# EAGLE design RWatch (EAGLE 7.3.0)
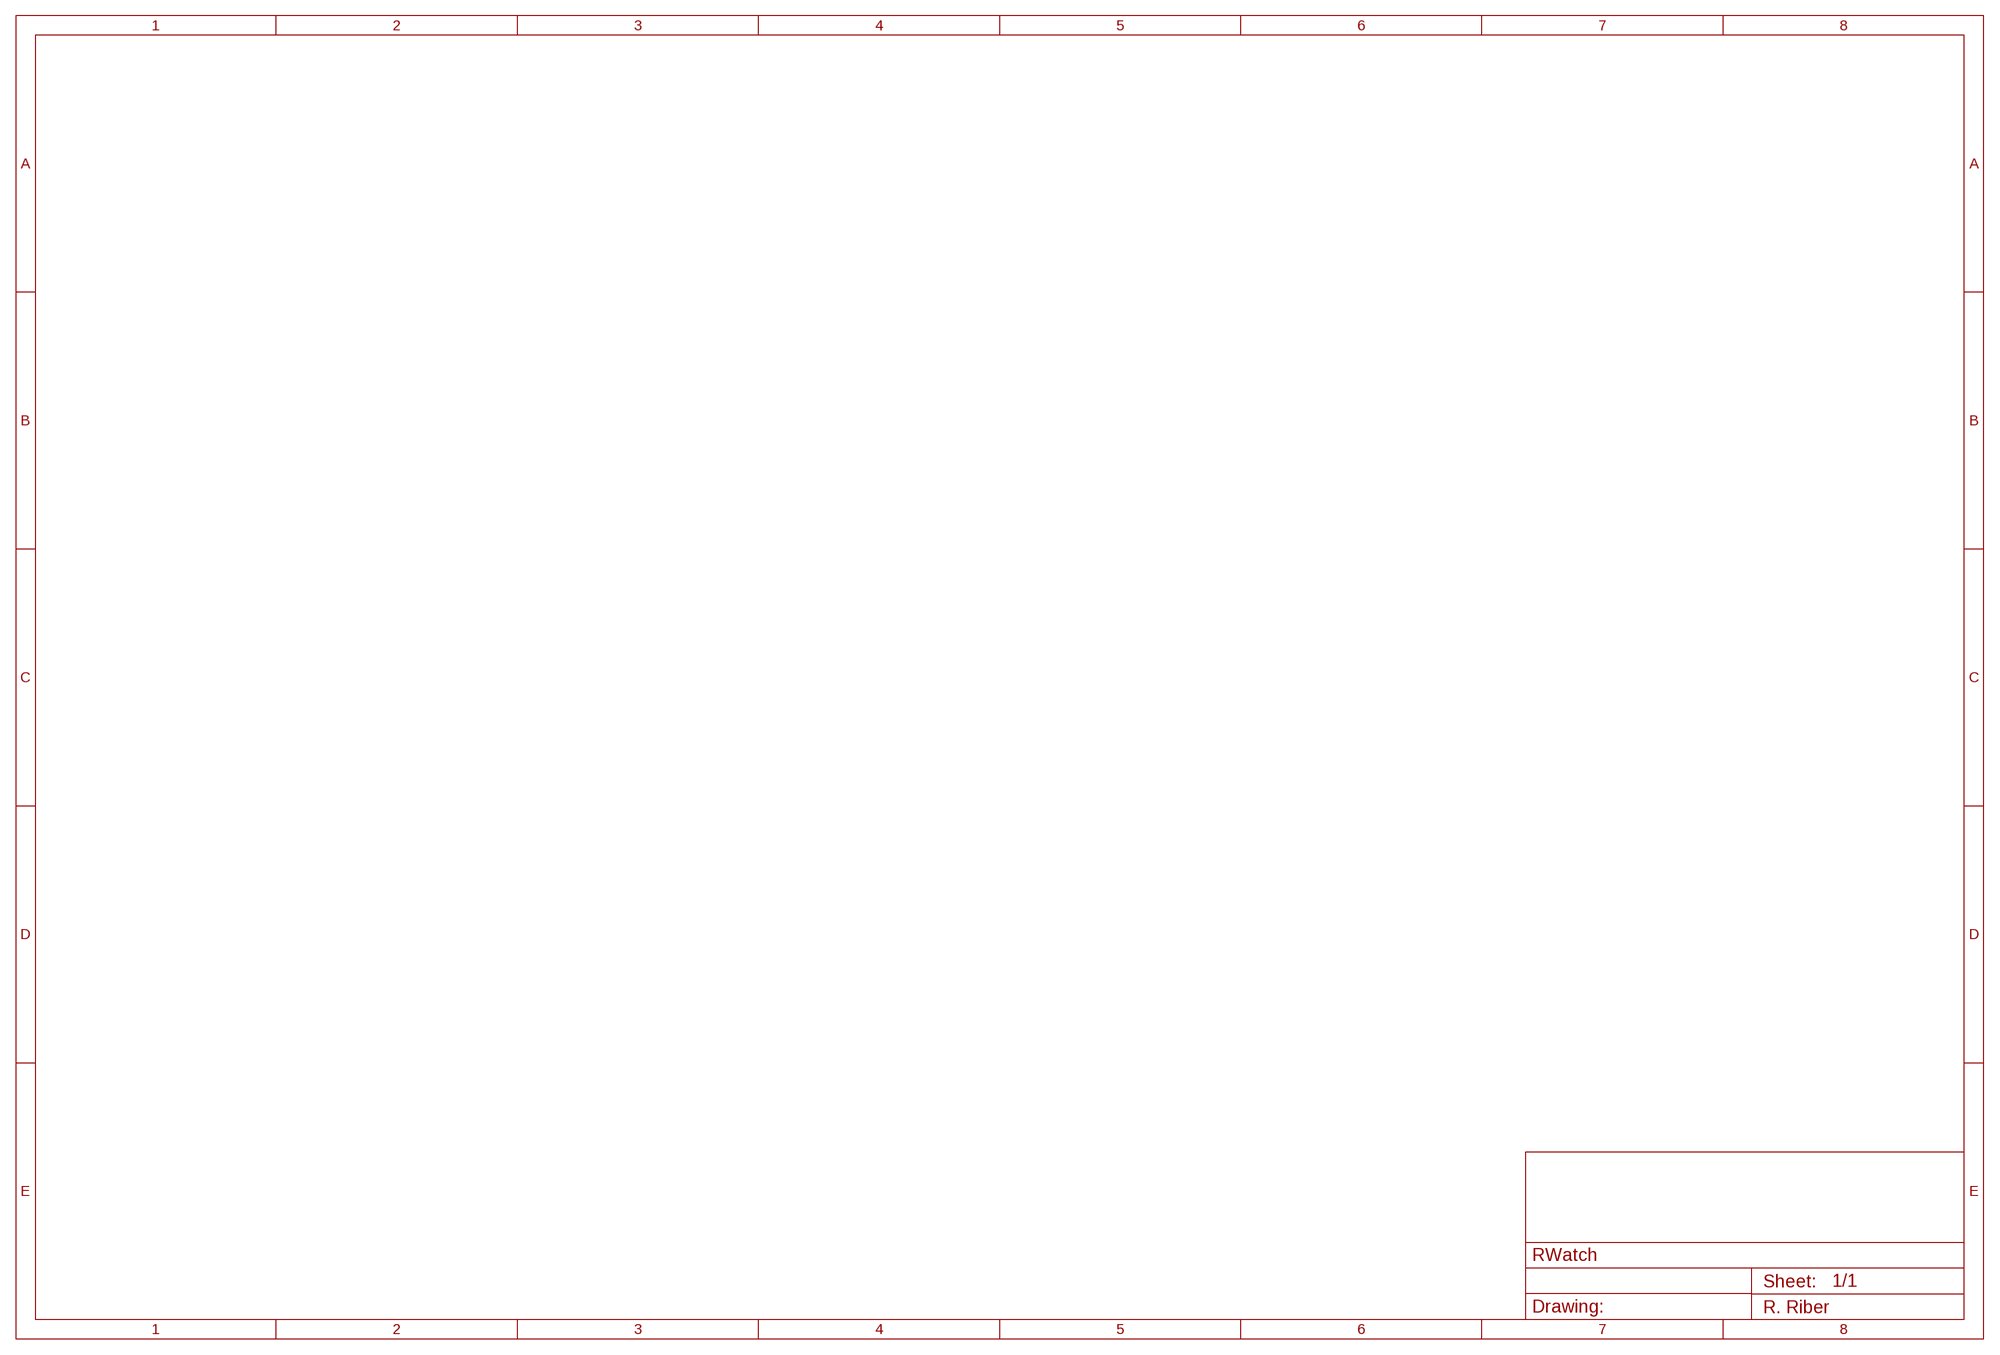
[diagram p0: schematic, sheet 1, part 1 of 2]
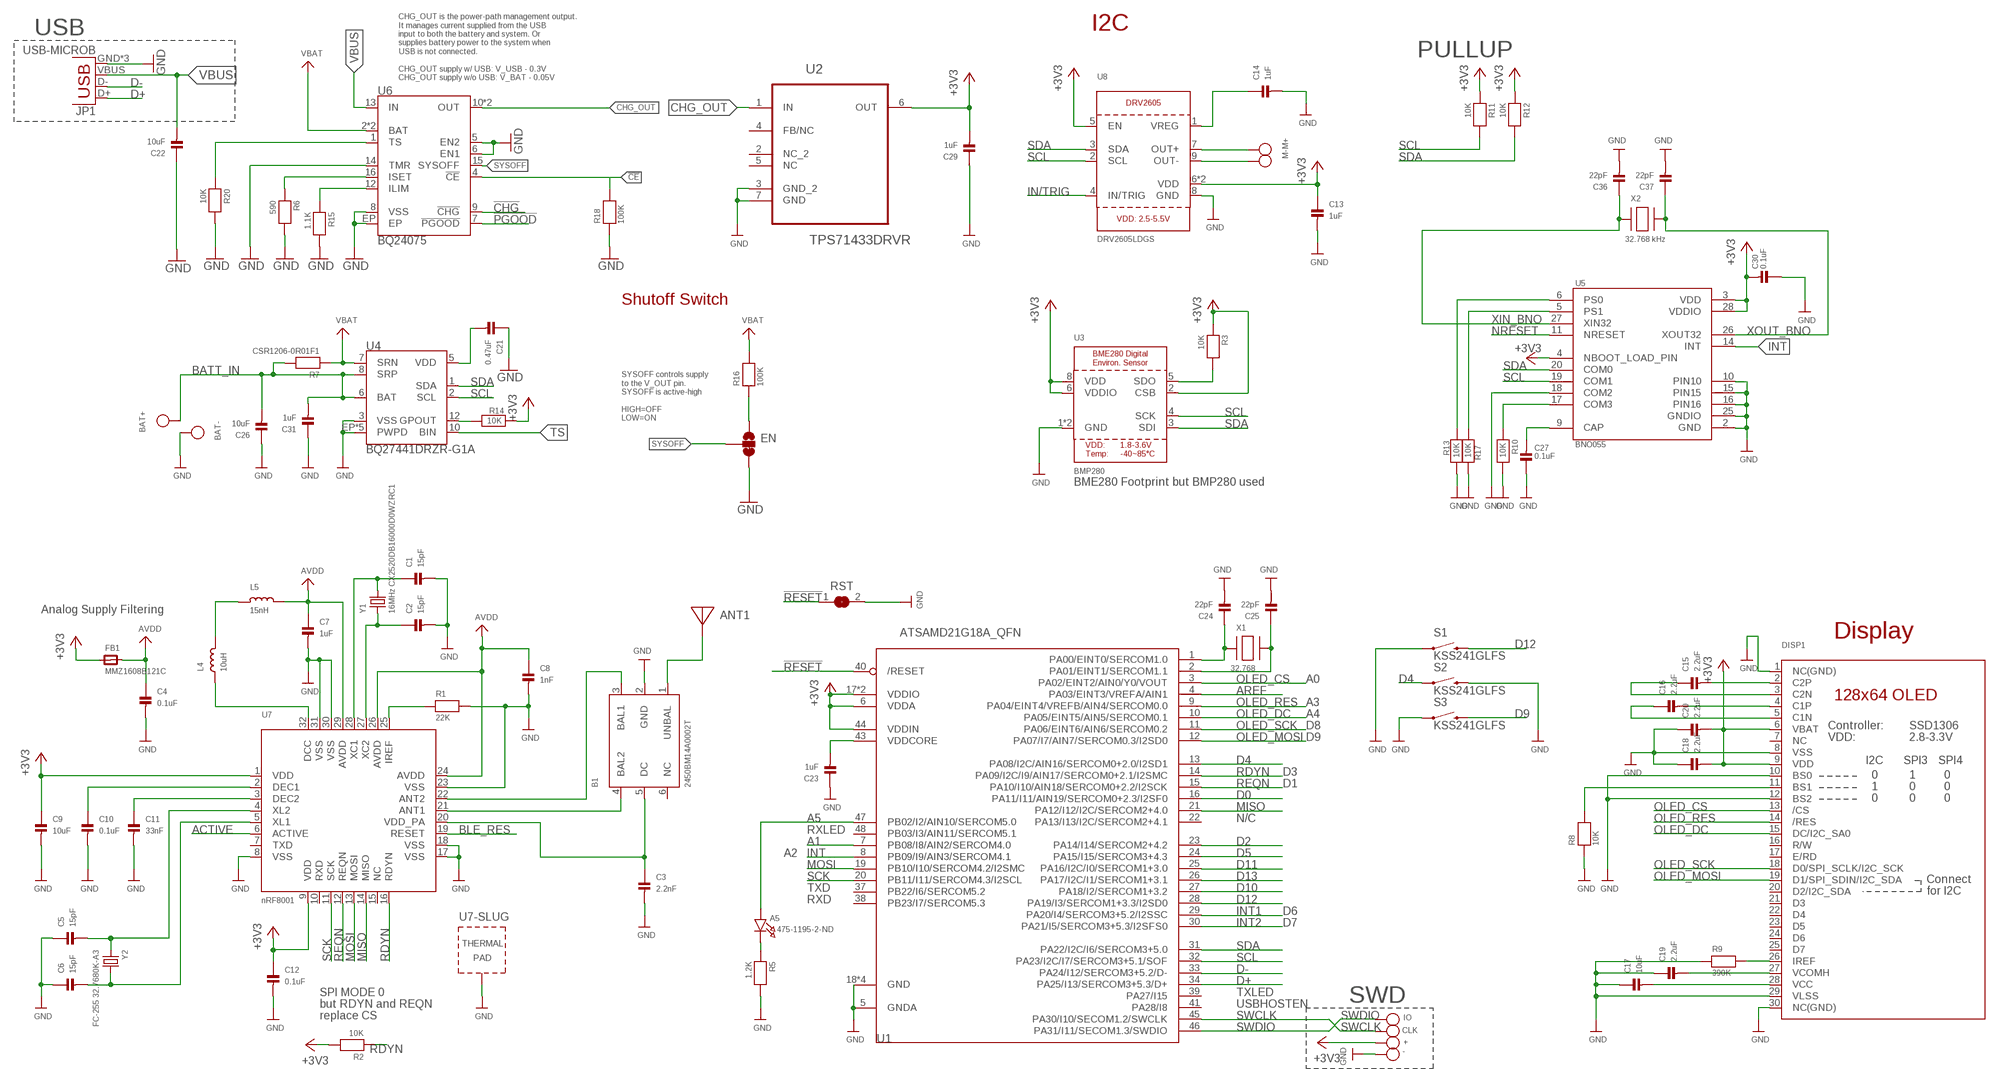
[diagram p1: schematic, sheet 1, part 2 of 2]

## Parts
+  TESTPOINTROUND1.5MM  [TESTPOINT_ROUND_1.5MM]
-  TESTPOINTROUND1.5MM  [TESTPOINT_ROUND_1.5MM]
A5  475-1195-2-ND  LED0603_NOOUTLINE  [CHIPLED_0603_NOOUTLINE]
ANT1  ANTENNA_PCBNRF8001_1.6MM  [ANT_PCB_2.4GHZ_NRF8001_1.6MM_1OZ]
B1  2450BM14A0002T  BALUN+LP_NORDIC  [BALUN0603]
BAT+  TESTPOINTROUND2MM  [TESTPOINT_ROUND_2MM]
BAT-  TESTPOINTROUND2MM  [TESTPOINT_ROUND_2MM]
C1  15pF  CAP_CERAMIC0402  [0402]
C2  15pF  CAP_CERAMIC0402  [0402]
C3  2.2nF  CAP_CERAMIC0402  [0402]
C4  0.1uF  CAP_CERAMIC0402  [0402]
C5  15pF  CAP_CERAMIC0402  [0402]
C6  15pF  CAP_CERAMIC0402  [0402]
C7  1uF  CAP_CERAMIC0402  [0402]
C8  1nF  CAP_CERAMIC0402  [0402]
C9  10uF  CAP_CERAMIC0402  [0402]
C10  0.1uF  CAP_CERAMIC0402  [0402]
C11  33nF  CAP_CERAMIC0402  [0402]
C12  0.1uF  CAP_CERAMIC0402  [0402]
C13  1uF  CAP_CERAMIC0402  [0402]
C14  1uF  CAP_CERAMIC0402  [0402]
C15  2.2uF  CAP_CERAMIC0402  [0402]
C16  2.2uF  CAP_CERAMIC0402  [0402]
C17  10uF  CAP_CERAMIC0603  [0603]
C18  2.2uF  CAP_CERAMIC0402  [0402]
C19  2.2uF  CAP_CERAMIC0402  [0402]
C20  2.2uF  CAP_CERAMIC0402  [0402]
C21  0.47uF  CAP_CERAMIC0402  [0402]
C22  10uF  CAP_CERAMIC0603  [0603]
C23  1uF  CAP_CERAMIC0402  [0402]
C24  22pF  CAP_CERAMIC0402  [0402]
C25  22pF  CAP_CERAMIC0402  [0402]
C26  10uF  CAP_CERAMIC0603  [0603]
C27  0.1uF  CAP_CERAMIC0402  [0402]
C29  1uF  CAP_CERAMIC0402  [0402]
C30  0.1uF  CAP_CERAMIC0402  [0402]
C31  1uF  CAP_CERAMIC0402  [0402]
C36  22pF  CAP_CERAMIC0402  [0402]
C37  22pF  CAP_CERAMIC0402  [0402]
CLK  TESTPOINTROUND1.5MM  [TESTPOINT_ROUND_1.5MM]
DISP1  DISP_OLED_UG-2864HSWEG01  [UG-2864HSWEG01_1.3_WRAPAROUND]
EN  JUMPER-PAD-3-2OF3_NC_BY_TRACE_SMALL  [PAD-JUMPER-3-2OF3_NC_BY_TRACE_YES_SILK_FULL_BOX]
FB1  MMZ1608B121C  FERRITE0805  [0805]
IO  TESTPOINTROUND1.5MM  [TESTPOINT_ROUND_1.5MM]
JP1  USB-MICROB  [USB-MICROB]
L4  10uH  INDUCTOR_0603  [_0603]
L5  15nH  INDUCTOR_0603  [_0603]
M+  TESTPOINTROUND2MM  [TESTPOINT_ROUND_2MM]
M-  TESTPOINTROUND2MM  [TESTPOINT_ROUND_2MM]
R1  22K  RESISTOR0402  [0402]
R2  10K  RESISTOR0402  [0402]
R3  10K  RESISTOR0402  [0402]
R5  1.2K  RESISTOR0402  [0402]
R6  590  RESISTOR0402  [0402]
R7  CSR1206-0R01F1  RESISTOR1206  [1206]
R8  10K  RESISTOR0402  [0402]
R9  390K  RESISTOR0402  [0402]
R10  10K  RESISTOR0402  [0402]
R11  10K  RESISTOR0402  [0402]
R12  10K  RESISTOR0402  [0402]
R13  10K  RESISTOR0402  [0402]
R14  10K  RESISTOR0402  [0402]
R15  1.1K  RESISTOR0402  [0402]
R16  100K  RESISTOR0402  [0402]
R17  10K  RESISTOR0402  [0402]
R18  100K  RESISTOR0402  [0402]
R20  10K  RESISTOR0402  [0402]
RST  SOLDERJUMPERREFLOW  [SOLDERJUMPER_REFLOW]
S1  KSS241GLFS  [KSS241GLFS]
S2  KSS241GLFS  [KSS241GLFS]
S3  KSS241GLFS  [KSS241GLFS]
U1  ATSAMD21G18A_QFN  [TQFN48_7MM]
U2  TPS71433DRVR  [SON65P200X200X80-7N]
U3  BMP280  BME280  [BME280]
U4  BQ27441DRZR-G1A  BQ27441-G1  [PDSO-N12]
U5  BNO055  [LGA28R50P4X10_380X520X100]
U6  BQ24075  [PVQFN-N16]
U7  nRF8001  NRF8001  [QFN32_5MM]
U8  DRV2605LDGS  DRV2605_SOP  [PSOP10]
X1  32.768  XTAL-3.2X1.5  [XTAL3215]
X2  32.768 kHz  XTAL-3.2X1.5  [XTAL3215]
Y1  16MHz CX2520DB16000D0WZRC1  CRYSTAL2.5X2.0MM  [CRYSTAL_2.5X2]
Y2  FC-255 32.7680K-A3  CRYSTALTHIN32K  [CRYSTAL_4.9X1.8]

## Nets
!CE!: R18.2 U6.4(!CE!)
!CHG!: U6.9(!CHG!)
!PGOOD!: U6.7(!PGOOD!)
!RESET: RST.1 U1.40(/RESET)
+3V3: +.P$1 C9.1 C12.1 C13.1 C18.2 C20.2 C29.2 C30.2 DISP1.6(VBAT) DISP1.9(VDD) FB1.1 R2.2 R3.1 R11.1 R12.1 R14.1 U1.6(VDDA) U1.17(VDDIO) U1.36(VDDIO) U1.44(VDDIN) U2.6(OUT) U3.2(CSB) U3.6(VDDIO) U3.8(VDD) U5.3(VDD) U5.4(NBOOT_LOAD_PIN) U5.28(VDDIO) U7.1(VDD) U7.9(VDD) U8.5(EN) U8.6(VDD) U8.10(VDD)
A1: U1.7(PB08/I8/AIN2/SERCOM4.0)
A5: A5.A U1.47(PB02/I2/AIN10/SERCOM5.0)
ACTIVE: U7.6(ACTIVE)
AREF: U1.4(PA03/EINT3/VREFA/AIN1)
AVDD: C4.1 C7.1 C8.1 FB1.2 L5.2 U7.24(AVDD) U7.26(AVDD) U7.29(AVDD)
BATT_IN: BAT+.P$1 C26.2 C31.2 R7.2 U4.6(BAT) U4.8(SRP)
BLE_RES: U7.19(RESET)
CHG_OUT: U2.1(IN) U6.10(OUT) U6.11(OUT)
D0: U1.16(PA11/I11/AIN19/SERCOM0+2.3/I2SF0)
D2: U1.23(PA14/I14/SERCOM2+4.2)
D4: S2.1 U1.13(PA08/I2C/AIN16/SERCOM0+2.0/I2SD1)
D5: U1.24(PA15/I15/SERCOM3+4.3)
D9: S3.2
D10: U1.27(PA18/I2/SERCOM1+3.2)
D11: U1.25(PA16/I2C/I0/SERCOM1+3.0)
D12: S1.2 U1.28(PA19/I3/SERCOM1+3.3/I2SD0)
D13: U1.26(PA17/I2C/I1/SERCOM1+3.1)
D+: JP1.D+ U1.34(PA25/I13/SERCOM3+5.3/D+)
D-: JP1.D- U1.33(PA24/I12/SERCOM3+5.2/D-)
GND: -.P$1 B1.2(GND) BAT-.P$1 C1.2 C2.2 C3.2 C4.2 C5.1 C6.1 C7.2 C8.2 C9.2 C10.2 C11.2 C12.2 C13.2 C14.2 C17.1 C18.1 C19.1 C20.1 C21.1 C22.1 C23.1 C24.2 C25.2 C26.1 C27.1 C29.1 C30.1 C31.1 C36.2 C37.2 DISP1.1(NC(GND)) DISP1.8(VSS) DISP1.10(BS0) DISP1.12(BS2) DISP1.29(VLSS) DISP1.30(NC(GND)) EN.3 JP1.GND JP1.MT1(GND) JP1.MT2(GND) R1.2 R5.2 R6.2 R8.1 R9.1 R10.2 R13.2 R15.2 R17.2 R18.1 R20.2 RST.2 S1.1 S2.2 S3.1 U1.5(GNDA) U1.18(GND) U1.35(GND) U1.42(GND) U1.THERMAL(GND) U2.3(GND_2) U2.7(GND) U3.1(GND) U3.7(GND) U4.3(VSS) U4.EP1(PWPD) U4.EP2(PWPD) U4.EP3(PWPD) U4.EP4(PWPD) U4.EP(PWPD) U5.2(GND) U5.10(PIN10) U5.15(PIN15) U5.16(PIN16) U5.18(COM2) U5.25(GNDIO) U6.5(EN2) U6.6(EN1) U6.8(VSS) U6.14(TMR) U6.EP U7.8(VSS) U7.17(VSS) U7.18(VSS) U7.23(VSS) U7.30(VSS) U7.31(VSS) U7.33(TP) U8.8(GND)
ILIM: R15.1 U6.12(ILIM)
IN/TRIG: U8.4(IN/TRIG)
INT: U1.8(PB09/I9/AIN3/SERCOM4.1) U5.14(INT)
INT1: U1.29(PA20/I4/SERCOM3+5.2/I2SSC)
INT2: U1.30(PA21/I5/SERCOM3+5.3/I2SFS0)
ISET: R6.1 U6.16(ISET)
MISO: U1.21(PA12/I12/I2C/SERCOM2+4.0) U7.14(MISO)
MOSI: U1.19(PB10/I10/SERCOM4.2/I2SMC) U7.13(MOSI)
N$1: ANT1.FEED B1.1(UNBAL)
N$2: B1.3(BAL1) U7.22(ANT2)
N$3: B1.4(BAL2) U7.21(ANT1)
N$4: B1.5(DC) C3.1 U7.20(VDD_PA)
N$5: L4.2 L5.1
N$6: DISP1.11(BS1) R8.2
N$7: C11.1 U7.3(DEC2)
N$8: C10.1 U7.2(DEC1)
N$9: C1.1 U7.28(XC1) Y1.3
N$10: C2.1 U7.27(XC2) Y1.1
N$11: L4.1 U7.32(DCC)
N$12: R1.1 U7.25(IREF)
N$13: C21.2 U4.5(VDD)
N$14: C24.1 U1.1(PA00/EINT0/SERCOM1.0) X1.P$1
N$15: C25.1 U1.2(PA01/EINT1/SERCOM1.1) X1.P$2
N$16: R3.2 U3.5(SDO)
N$18: C14.1 U8.1(VREG)
N$21: R14.2 U4.12(GPOUT)
N$22: C5.2 U7.4(XL2) Y2.1
N$23: C6.2 U7.5(XL1) Y2.2
N$26: EN.1 R16.1
N$28: A5.C R5.1
N$29: C27.2 U5.9(CAP)
N$30: R10.1 U5.17(COM3)
N$31: R17.1 U5.5(PS1)
N$32: R13.1 U5.6(PS0)
N$34: DISP1.26(IREF) R9.2
N$35: C15.2 DISP1.2(C2P)
N$36: C15.1 DISP1.3(C2N)
N$37: C16.2 DISP1.4(C1P)
N$38: C16.1 DISP1.5(C1N)
N$39: C17.2 DISP1.28(VCC)
N$40: C19.2 DISP1.27(VCOMH)
NRESET: U5.11(NRESET)
OLED_CS: DISP1.13(/CS) U1.3(PA02/EINT2/AIN0/Y0/VOUT)
OLED_DC: DISP1.15(DC/I2C_SA0) U1.10(PA05/EINT5/AIN5/SERCOM0.1)
OLED_MOSI: DISP1.19(D1/SPI_SDIN/I2C_SDA) U1.12(PA07/I7/AIN7/SERCOM0.3/I2SD0)
OLED_RES: DISP1.14(/RES) U1.9(PA04/EINT4/VREFB/AIN4/SERCOM0.0)
OLED_SCK: DISP1.18(D0/SPI_SCLK/I2C_SCK) U1.11(PA06/EINT6/AIN6/SERCOM0.2)
OUT+: M+.P$1 U8.7(OUT+)
OUT-: M-.P$1 U8.9(OUT-)
RDYN: R2.1 U1.14(PA09/I2C/I9/AIN17/SERCOM0+2.1/I2SMC) U7.16(RDYN)
REQN: U1.15(PA10/I10/AIN18/SERCOM0+2.2/I2SCK) U7.12(REQN)
SCK: U1.20(PB11/I11/SERCOM4.3/I2SCL) U7.11(SCK)
SCL: R11.2 U1.32(PA23/I2C/I7/SERCOM3+5.1/SOF) U3.4(SCK) U4.2(SCL) U5.19(COM1) U8.2(SCL)
SDA: R12.2 U1.31(PA22/I2C/I6/SERCOM3+5.0) U3.3(SDI) U4.1(SDA) U5.20(COM0) U8.3(SDA)
SWCLK: CLK.P$1 U1.45(PA30/I10/SECOM1.2/SWCLK)
SWDIO: IO.P$1 U1.46(PA31/I11/SECOM1.3/SWDIO)
SYSOFF: EN.2 U6.15(SYSOFF)
TS: R20.1 U4.10(BIN) U6.1(TS)
VBAT: R7.1 R16.2 U4.7(SRN) U6.2(BAT) U6.3(BAT)
VBUS: C22.2 JP1.VBUS U6.13(IN)
VDDCORE1: C23.2 U1.43(VDDCORE)
XIN_BNO: C36.1 U5.27(XIN32) X2.P$1
XOUT_BNO: C37.1 U5.26(XOUT32) X2.P$2
Unconnected: B1.6(NC) DISP1.7(NC) DISP1.16(R/W) DISP1.17(E/RD) DISP1.20(D2/I2C_SDA) DISP1.21(D3) DISP1.22(D4) DISP1.23(D5) DISP1.24(D6) DISP1.25(D7) U1.22(PA13/I13/I2C/SERCOM2+4.1) U1.37(PB22/I6/SERCOM5.2) U1.38(PB23/I7/SERCOM5.3) U1.39(PA27/I15) U1.41(PA28/I8) U1.48(PB03/I3/AIN11/SERCOM5.1) U2.2(NC_2) U2.4(FB/NC) U2.5(NC) U7.7(TXD) U7.10(RXD) U7.15(NC)

## Notes on the sheet
- CHG_OUT is the power-path management output.
  It manages current supplied from the USB 
  input to both the battery and system. Or
  supplies battery power to the system when 
  USB is not connected.
  
  CHG_OUT supply w/ USB: V_USB - 0.3V
  CHG_OUT supply w/o USB: V_BAT - 0.05V
- USB | I2C
- PULLUP
- Shutoff Switch
- SYSOFF controls supply 
  to the V_OUT pin.
  SYSOFF is active-high
  
  HIGH=OFF
  LOW=ON
- BME280 Footprint but BMP280 used
- Analog Supply Filtering
- Display
- A0
- A3
- A4
- D8
- D9
- D3
- D1
- N/C
- RXLED
- A2
- TXD
- RXD
- D6
- D7
- SPI MODE 0 | TXLED
- SWD
- but RDYN and REQN | USBHOSTEN
- replace CS

## Library data of the parts
+ - BAT+ BAT- CLK IO M+ M- = microbuilder:TESTPOINT: Test Point Various test points for characterisation and PCB testing TESTPOINT_SMT - Compact Surface Mount Test Point [Digikey: 5016KTR-ND]
A5 = microbuilder:LED: LED 0603 - 0603 Surface Mount Package 2mA: Green LED - Low Power (3.9mcd, 2ma, 1.7Vf) - Digikey: 475-2709-2-ND Orange LED - Low Power (9.8mcd, 2ma, 1.8Vf) - Digikey: 475-1194-2-ND Red LED - Low Power (5mcd, 2ma, 1.8Vf) - Digikey: 475-1195-2-ND Yellow LED - Low Power (7mcd, 2ma, 1.8Vf) - Digikey: 475-1196-2-ND 5mA: Blue LED - Low Power (17mcd, 5ma, 2.9Vf) - Digikey: LNJ937W8CRACT-ND 0805 - 0805 Surface Mount Package 2mA: Red LED (8.8mcd, 2mA, 1.8Vf, Clear) - Low Power [Digikey: 475-2510-1-ND] Green LED (5mcd, 2mA, 1.8Vf, Clear) - Low Power [Digikey: 475-2730-1-ND] Yellow LED (11.3mcd, 2mA, 1.8Vf, Clear) - Low Power [Digikey: 475-2555-1-ND] 20mA: Red LED (104mcd, 20mA, Diffused) - LS R976 [Digikey: 475-1278-6-ND] Red LED (12mcd, 20mA, 2.0Vf, Clear) - APT2012EC [Digikey: 754-1128-1-ND] Green LED (15mcd, 20mA, 2.2Vf, Clear) - APT2012GC [Digikey: 754-1131-1-ND] Orange LED (160mcd, 20mA, 2.1Vf, Clear) - APT2012SECK [Digikey: 754-1130-1-ND] 1206 - 1206 Surface Mount Package Green LED (26mcd, 20mA, Diffused) - LG N971 [Digikey: 475-1407-6-ND] Red LED (15mcd, 20mA, Diffused) - LH N974 [Digikey: 475-1416-6-ND]
ANT1 = microbuilder:ANTENNA_PCB: Various pre-calculated PCB Antennas NRF8001 1.6mm 1Oz - 2.4GHz PCB antenna for 1.6mm PCBs with 1oz copper, double-sided boards (no GND plan beneath antenna). See nRF2740 production files for further information and impedance matching network. 868MHz/2.4GHz DUALBAND - Dual 868MHz and 2.4GHz centered antenna based on board #6 of the CC-ANTENNA-DK from Chipcon/TI
B1 = microbuilder:BALUN+LP_NORDIC: Balun + Low Pass Filter 0603 Johanson 2450BM14A0002 (nRF8001) - 2400-2500 MHz Balun + Filter
C1-C27 C29-C31 C36 C37 = microbuilder:CAP_CERAMIC: Ceramic Capacitors 0402 - 0402 Surface Mount Capacitors 16pF 50V 5% [Digikey: 445-4899-2-ND] 18pF 50V 5% [Digikey: 490-1281-2-ND] 22pF 50V 5% [Digikey: 490-1283-2-ND] 68pF 50V 5% [Digikey: 490-1289-2-ND] 0.1uF 10V 10% [Digikey: 490-1318-2-ND] 1.0uF 6.3V 10% [Digikey: 490-1320-2-ND] 0603 - 0603 Surface Mount Capacitors 16 pF 50V 5% [Digikey: 445-5051-2-ND] 22 pF 50V [Digikey: PCC220ACVTR-ND] 33 pF 50V 5% [Digikey: 490-1415-1-ND] 56pF 50V 5% [Digikey: 490-1421-1-ND] 220pF 50V 5% [Digikey: 445-1285-1-ND] 680 pF 50V 2200 pF 50V 5% C0G [Digikey: 445-1297-1-ND] 5600 pF 100V 5% X7R [Digikey: 478-3711-1-ND] 0.1 µF 25V 10% [Digikey: PCC2277TR-ND] 0.22 µF 16V 10% X7R [Digikey: 445-1318-1-ND] 1.0 µF 25V 10% [Digikey: 445-5146-2-ND] 0603 - RF Specific 3pF 250V +/-0.1pF RF [Digikey: 712-1347-1-ND] 18 pF 250V 5% [Digikey: 478-3505-1-ND or 712-1322-1-ND] 56 pF 250V 5% C0G RF [Digikey: 490-4867-1-ND] 68 pF 250V RF [Digikey: 490-4868-1-ND] 0805 - 0805 Surface Mount Capacitors 220 pF 250V 2% RF Ceramic Capacitor [Digikey: 712-1398-1-ND] 1000 pF 50V 2% NP0 Ceramic Capacitor [Digikey: 478-3760-1-ND] 0.1 µF 25V 10% Ceramic Capacitor [Digikey: PCC1828TR-ND] 1.0 µF 16V 10% Ceramic Capacitor[Digikey: 490-1691-2-ND] 10.0 µF 10V 10% Ceramic Capacitor[Digikey: 709-1228-1-ND] 10.0 uF 16V 10% Ceramic Capacitor [Digikey: 478-5165-2-ND] 47 uF 6.3V 20% Ceramic Capacitor [Digikey: 587-1779-1-ND or 399-5506-1-ND] 1206 - 1206 Surface Mount Capacitors 47uF 10V 20% Ceramic Capacitor [Digikey: 490-5528-1-ND or 399-5508-1-ND or 445-6010-1-ND] 100uF 6.3V -20%, +80% Y5V Ceramic Capacitor (Digikey: 490-4512-1-ND, Mouser: 81-GRM31CF50J107ZE1L)
DISP1 = microbuilder:DISP_OLED_UG-2864HSWEG01: UG-2864HSWEG01 OLED display Both 1.3" and 0.96" models share the same FPC tab footprint, only the screen dimensions vary.
EN = SparkFun-Passives:JUMPER-PAD-3-2OF3_NC_BY_TRACE
FB1 = microbuilder:FERRITE: Ferrite Bead 0603 MMZ1608B121C - 120 Ohm @ 100MHz, 600mA, 0.15 Ohm DC Resistance - Digikey: 445-2164-1-ND BK1608HW121-T - 120 Ohm, 600mA Ferrite Chip - Digikey: 587-1876-2-ND 0805 HZ0805B272R-10 - 2.7K Ohm @ 100MHz, 200mA, 0.8 Ohm DC Resistance - Digikey: 240-2504-1-ND (see also Murata BLM21BD272SN1L) MMZ2012Y152B - 1.5K Ohm @ 100MHz, 500mA, 0.4 Ohm DC Resistance - Digikey: 445-1560-1-ND - Mainly for high frequency (80-400MHz) MMZ2012R102A - 1K Ohm @ 100MHz, 500mA, 0.3 Ohm DC Resistance - Digikey: 445-1555-2-ND - More general purpose (10-200MHz)
JP1 = SparkFun-Connectors:USB: USB Connectors USB-B-PTH is fully proven SKU : PRT-00139/CONN-08278 USB-miniB is fully proven SKU : PRT-00587 USB-A-PCB is untested. USB-A-H is throughly reviewed, but untested. Spark Fun Electronics SKU : PRT-00437 USB-B-SMT is throughly reviewed, but untested. Needs silkscreen touching up. USB-A-S has not been used/tested USB-MB-H has not been used/tested USB-MICROB has been used. CONN-09505; MF: FCI; MPN: 10104110-0001LF; OC_FARNELL: 2293753; PROD_ID: CONN-09505
L4 L5 = microbuilder:INDUCTOR: Inductors 0603: 10nH Ceramic Inductor - microwire antenna/RF (Digikey: 712-1434-2-ND) 0805: 560nH Ceramic Inductor - RF (Digikey: 553-1047-1-ND) 270nH Ceramic Inductor - Q = 40@250MHz, +-5%, 1 Ohm DC Resistance (Digikey: 535-10506-2-ND) 1007 (2518 Metric) SMT: 10µH 10% 250mOhm 820mA 1007 Inductor (Digikey: 587-2189-1-ND) 22µH 10% 500mOhm 580mA 1007 Inductor (Digikey: 587-2190-1-ND) 47µH 10% 950mOhm 420mA 1007 Inductor (Digikey: 587-2191-1-ND) 47µH 5% 100mOhm 1A 1008 Inductor (Digikey: 732-1816-1-ND) 5.0x5.0mm (Taiyo Yuden NR5040 Series) 6.8µH 20% 2.3A 64mOhm Inductor (Digikey: 587-2374-2-ND) 5.0x5.0mm (TDK VLC5045 Series) 4.7µH 20% 3.3A 34mOhm Inductor (Digikey: 445-6526-1-ND) 6.8µH 20% 2.7A 46mOhm Inductor (Digikey: 445-6527-1-ND) 6.0x6.0mm (TDK VLC6045 Series) 4.7µH 20% 3.8A 27mOhm Inductor (Digikey: 445-6538-2-ND) 6.8µH 20% 3A 41mOhm Inductor (Digikey: 445-6540-1-ND) 6.2µH 30% 2.2A 45mOhm Inductor (Digikey: SRR5028-6R2YCT-ND) - Not TDK VLC6045 but footprint should match 6.0x6.0mm (TDK SLF6045 Series) 6.8uH 30% 2A 33mOhm Inductor (Digikey: 445-4572-1-ND, Mouser: 810-SLF645T6R8N2R0PF)
R1 R2 R7-R9 = microbuilder:RESISTOR: Resistors 0402 - 0402 Surface Mount Package 22 Ohm 1% 1/16W [Digikey: 311-22.0LRTR-ND] 33 Ohm 5% 1/16W 1.0K 5% 1/16W 1.5K 5% 1/16W 2.0K 1% 1/16W 10.0K 1% 1/16W [Digikey: 311-10.0KLRTR-ND] 10.0K 5% 1/16W [Digikey: RMCF0402JT10K0TR-ND] 12.1K 1% 1/16W [Digikey: 311-22.0LRTR-ND] 100.0K 5% 1/16W 0603 - 0603 Surface Mount Package 0 Ohm 1/10 Watt 1% Resistor 15 Ohm 1/10 Watt 1% Resistor 33 Ohm 1/10 Watt 1% Resistor 49.9 Ohm 1/10 Watt 1% Resistor 100 Ohm 1/10 Watt 1% Resistor 150 Ohm 1/10 Watt 1% Resistor 240 Ohm 1/10 Watt 1% Resistor 390 Ohm 1/10 Watt 1% Resistor 560 Ohm 1/10 Watt 1% Resistor 680 Ohm 1/10 Watt 1% Resistor 750 Ohm 1/10 Watt 1% Resistor 1.0K Ohm 1/10 Watt 1% Resistor 1.5K Ohm 1/10 Watt 1% Resistor 2.0K Ohm 1/10 Watt 1% Resistor 2.2K Ohm 1/10 Watt 1% Resistor 3.3K Ohm 1/10 Watt 1% Resistor 4.7K Ohm 1/10 Watt 1% Resistor 10.0K Ohm 1/10 Watt 1% Resistor 12.0K Ohm 1/10 Watt 1% Resistor 12.1K Ohm 1/10 Watt 1% Resistor 20.0K Ohm 1/10 Watt 1% Resistor 33.0K Ohm 1/10 Watt 1% Resistor 100.0K Ohm 1/10 Watt 1% Resistor 0805 - 0805 Surface Mount Package 0 Ohm 1/8 Watt 1% Resistor 33 Ohm 1/8 Watt 1% Resistor 100 Ohm 1/8 Watt 1% Resistor 150 Ohm 1/8 Watt 1% Resistor 200 Ohm 1/8 Watt 1% Resistor 240 Ohm 1/8 Watt 1% Resistor 330 Ohm 1/8 Watt 1% Resistor 390 Ohm 1/8 Watt 1% Resistor 470 Ohm 1/8 Watt 1% Resistor 1.0K Ohm 1/8 Watt 1% Resistor 1.5K Ohm 1/8 Watt 1% Resistor 2.0K Ohm 1/8 Watt 1% Resistor 4.7K Ohm 1/8 Watt 1% Resistor 5.1K Ohm 1/8 Watt 1% Resistor 5.6K Ohm 1/8 Watt 1% Resistor 10.0K Ohm 1/8 Watt 1% Resistor 22.0K Ohm 1/8 Watt 1% Resistor 33.0K Ohm 1/8 Watt 1% Resistor 100K Ohm 1/8 Watt 1% Resistor 1206 - 1206 Surface Mount Package 2012 - 2010 Surface Mount Package 0.11 Ohm 1/2 Watt 1% Resistor - Digikey: RHM.11UCT-ND
R3 R6 R10-R15 R17 R20 = microbuilder:RESISTOR: Resistors 0402 - 0402 Surface Mount Package 22 Ohm 1% 1/16W [Digikey: 311-22.0LRTR-ND] 33 Ohm 5% 1/16W 1.0K 5% 1/16W 1.5K 5% 1/16W 2.0K 1% 1/16W 10.0K 1% 1/16W [Digikey: 311-10.0KLRTR-ND] 10.0K 5% 1/16W [Digikey: RMCF0402JT10K0TR-ND] 12.1K 1% 1/16W [Digikey: 311-22.0LRTR-ND] 100.0K 5% 1/16W 0603 - 0603 Surface Mount Package 0 Ohm 1/10 Watt 1% Resistor 15 Ohm 1/10 Watt 1% Resistor 33 Ohm 1/10 Watt 1% Resistor 49.9 Ohm 1/10 Watt 1% Resistor 100 Ohm 1/10 Watt 1% Resistor 150 Ohm 1/10 Watt 1% Resistor 240 Ohm 1/10 Watt 1% Resistor 390 Ohm 1/10 Watt 1% Resistor 560 Ohm 1/10 Watt 1% Resistor 680 Ohm 1/10 Watt 1% Resistor 750 Ohm 1/10 Watt 1% Resistor 1.0K Ohm 1/10 Watt 1% Resistor 1.5K Ohm 1/10 Watt 1% Resistor 2.0K Ohm 1/10 Watt 1% Resistor 2.2K Ohm 1/10 Watt 1% Resistor 3.3K Ohm 1/10 Watt 1% Resistor 4.7K Ohm 1/10 Watt 1% Resistor 10.0K Ohm 1/10 Watt 1% Resistor 12.0K Ohm 1/10 Watt 1% Resistor 12.1K Ohm 1/10 Watt 1% Resistor 20.0K Ohm 1/10 Watt 1% Resistor 33.0K Ohm 1/10 Watt 1% Resistor 100.0K Ohm 1/10 Watt 1% Resistor 0805 - 0805 Surface Mount Package 0 Ohm 1/8 Watt 1% Resistor 33 Ohm 1/8 Watt 1% Resistor 100 Ohm 1/8 Watt 1% Resistor 150 Ohm 1/8 Watt 1% Resistor 200 Ohm 1/8 Watt 1% Resistor 240 Ohm 1/8 Watt 1% Resistor 330 Ohm 1/8 Watt 1% Resistor 390 Ohm 1/8 Watt 1% Resistor 470 Ohm 1/8 Watt 1% Resistor 1.0K Ohm 1/8 Watt 1% Resistor 1.5K Ohm 1/8 Watt 1% Resistor 2.0K Ohm 1/8 Watt 1% Resistor 4.7K Ohm 1/8 Watt 1% Resistor 5.1K Ohm 1/8 Watt 1% Resistor 5.6K Ohm 1/8 Watt 1% Resistor 10.0K Ohm 1/8 Watt 1% Resistor 22.0K Ohm 1/8 Watt 1% Resistor 33.0K Ohm 1/8 Watt 1% Resistor 100K Ohm 1/8 Watt 1% Resistor 1206 - 1206 Surface Mount Package 2012 - 2010 Surface Mount Package 0.11 Ohm 1/2 Watt 1% Resistor - Digikey: RHM.11UCT-ND; MF: VISHAY; MPN: CRCW060310K0FKEA; OC_FARNELL: 1469748
R5 R16 R18 = microbuilder:RESISTOR: Resistors 0402 - 0402 Surface Mount Package 22 Ohm 1% 1/16W [Digikey: 311-22.0LRTR-ND] 33 Ohm 5% 1/16W 1.0K 5% 1/16W 1.5K 5% 1/16W 2.0K 1% 1/16W 10.0K 1% 1/16W [Digikey: 311-10.0KLRTR-ND] 10.0K 5% 1/16W [Digikey: RMCF0402JT10K0TR-ND] 12.1K 1% 1/16W [Digikey: 311-22.0LRTR-ND] 100.0K 5% 1/16W 0603 - 0603 Surface Mount Package 0 Ohm 1/10 Watt 1% Resistor 15 Ohm 1/10 Watt 1% Resistor 33 Ohm 1/10 Watt 1% Resistor 49.9 Ohm 1/10 Watt 1% Resistor 100 Ohm 1/10 Watt 1% Resistor 150 Ohm 1/10 Watt 1% Resistor 240 Ohm 1/10 Watt 1% Resistor 390 Ohm 1/10 Watt 1% Resistor 560 Ohm 1/10 Watt 1% Resistor 680 Ohm 1/10 Watt 1% Resistor 750 Ohm 1/10 Watt 1% Resistor 1.0K Ohm 1/10 Watt 1% Resistor 1.5K Ohm 1/10 Watt 1% Resistor 2.0K Ohm 1/10 Watt 1% Resistor 2.2K Ohm 1/10 Watt 1% Resistor 3.3K Ohm 1/10 Watt 1% Resistor 4.7K Ohm 1/10 Watt 1% Resistor 10.0K Ohm 1/10 Watt 1% Resistor 12.0K Ohm 1/10 Watt 1% Resistor 12.1K Ohm 1/10 Watt 1% Resistor 20.0K Ohm 1/10 Watt 1% Resistor 33.0K Ohm 1/10 Watt 1% Resistor 100.0K Ohm 1/10 Watt 1% Resistor 0805 - 0805 Surface Mount Package 0 Ohm 1/8 Watt 1% Resistor 33 Ohm 1/8 Watt 1% Resistor 100 Ohm 1/8 Watt 1% Resistor 150 Ohm 1/8 Watt 1% Resistor 200 Ohm 1/8 Watt 1% Resistor 240 Ohm 1/8 Watt 1% Resistor 330 Ohm 1/8 Watt 1% Resistor 390 Ohm 1/8 Watt 1% Resistor 470 Ohm 1/8 Watt 1% Resistor 1.0K Ohm 1/8 Watt 1% Resistor 1.5K Ohm 1/8 Watt 1% Resistor 2.0K Ohm 1/8 Watt 1% Resistor 4.7K Ohm 1/8 Watt 1% Resistor 5.1K Ohm 1/8 Watt 1% Resistor 5.6K Ohm 1/8 Watt 1% Resistor 10.0K Ohm 1/8 Watt 1% Resistor 22.0K Ohm 1/8 Watt 1% Resistor 33.0K Ohm 1/8 Watt 1% Resistor 100K Ohm 1/8 Watt 1% Resistor 1206 - 1206 Surface Mount Package 2012 - 2010 Surface Mount Package 0.11 Ohm 1/2 Watt 1% Resistor - Digikey: RHM.11UCT-ND; MF: MULTICOMP; MPN: MC0063W06031221R; OC_FARNELL: 1170720
RST = microbuilder:SOLDERJUMPER: SMD Solder JUMPER Solder the two pads together to create a connection, or remove the solder to break it. REFLOW - Use this footprint for solder paste and reflow ovens. WAVE - Use this footprint for hand-soldering (larger pads). CLOSED - Has a trace between the two pads to ensure it is closed by default. The trace needs to be cut to disable the jumper, and can be closed again by creating a solder bridge between the two pads.
S1-S3 = Rafael's Library:KSS241GLFS
U1 = Rafael's Library:ATSAMD21G18A
U2 = TPS71433DRVR:TPS71433DRVR: LOW-DROPOUT LINEAR REGULATOR; AVAILABILITY: Good; DESCRIPTION: 80mA, 10V, Quiescent Current 3.0?A, LDO Linear Regulator in SC70 or SON2x2 6-WSON -40 to 125; MF: Texas Instruments; MP: TPS71433DRVR; PACKAGE: None; PRICE: 0.39 USD
U3 = microbuilder:BME280: BME280 - Environmental Sensor (I2C + SPI)
U4 = SparkFun-PowerIC:BQ27441-G1: Texas Instruments BQ27441-G1 LiPo Battery Fuel Gauge The Texas Instruments bq27441-G1 fuel gauge is a microcontroller peripheral that provides system-side fuel gauging for single-cell Li-Ion batteries. The device requires minimal user configuration and system microcontroller firmware development. The bq27441-G1 battery fuel gauge uses the patented Impedance Track™ algorithm for fuel gauging, and provides information such as remaining battery capacity (mAh), state-of-charge (%), and battery voltage (mV). Datasheet <http://www.ti.com/product/BQ27441-G1/datasheet> SparkFun Products SparkFun Battery Babysitter <https://www.sparkfun.com/products/13777> (PRT-13777); PROD_ID: IC-13220
U5 = BNO055:BNO055: BNO055 9-axis Absolute Orientation Sensor ( SiP ) w/Sensors and Sensor Fusion; AVAILABILITY: Good; DESCRIPTION: BNO055 9-axis Absolute Orientation Sensor ( SiP ) w/Sensors and Sensor Fusion; MF: Bosch; MP: BNO055; PACKAGE: LGA-28 Bosch; PRICE: 9.48 USD
U6 = battery-management-temp:BQ24075; PROD_ID: IC-13219
U7 = microbuilder:NRF8001: nRF8001 - Bluetooth Low-Energy Transceiver VDD: 1.9-3.6V Temp: -40°C - 85°C
U8 = microbuilder:DRV2605: DRV2605 - Haptic Driver for ERM/LRA Motors
X1 X2 = adafruit2:XTAL: Low cost SMT crystals, no capacitors included http://www.ladyada.net/library/eagle
Y1 Y2 = microbuilder:CRYSTAL: Crystals HC49UP - Surface Mount Crystal 4.0MHz 18pF +/-30ppm Surface Mount Crystal [Digikey: 535-9857-1-ND] 12.0 MHz Surface Mount Crystal [Digikey: 535-9869-6-ND] 25.0 MHz Surface Mount Crystal [Digikey: 535-9078-1-ND] 2.5 x 2.0mm - MEMs SMT Crystal 16.0 MHz 10pF 20ppm 2.5 x 2.0mm Crystal [Digikey -40-85°C: 535-10923-1-ND] 3.2 x 2.5mm - MEMs SMT Crystal 12.0 MHz 8pF 15ppm 3.2 x 2.5mm Crystal [Digikey: -10-70°C: 644-1047-1-ND -40-125°C: 644-1128-1-ND] 16.0 MHz 8pF 15ppm 3.2 x 2.5mm Crystal [Digikey: -10-70°C: 644-1049-1-ND -40-125°C: 644-1129-2-ND] 16.0 MHz 10pF 10ppm 3.2 x 2.5mm Crystal [Digikey: 644-1100-1-ND] 27.12 MHz 18pF 30ppm 3.2 x 2.5mm Crystal [Digikey: 887-1424-1-ND] 27.12MHz 10pF 10ppm 3.2 x 2.5mm Crystal [Digikey: 887-1329-1-ND] 4.9 x 1.8mm - MEMs SMT Crystal 32.768 KHz 12.5pF 20ppm 4.9 x 1.8mm Crystal [Digikey: SE2415CT-ND] 8.0 x 3.8mm - Surface Mount Crystal 32.768kHz 12.5pF 20ppm -40°C-85°C [Digikey: 535-9166-2-ND] Cylinder 32.768KHz Cylinder Crystal (2x6mm body) [Ex. Digikey: 300-8341-2-ND]

## Board
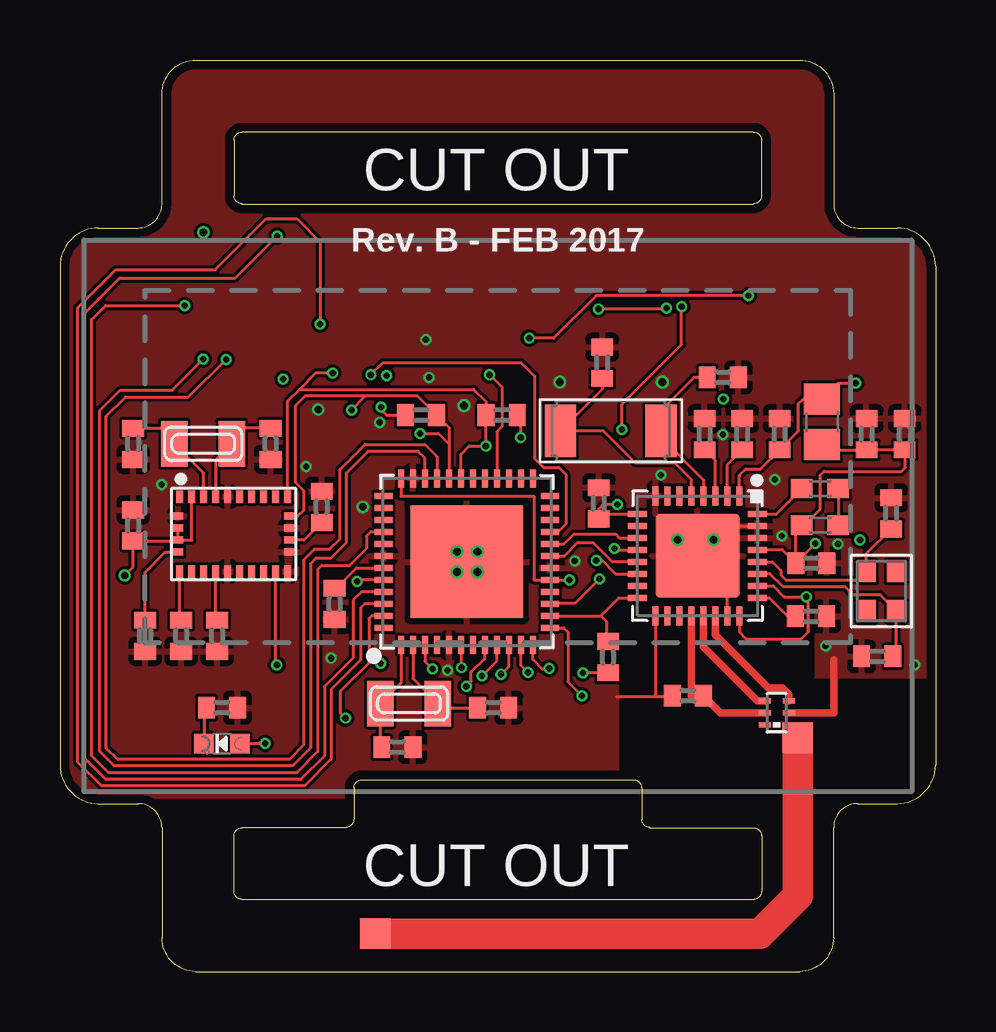
[diagram p2: board, top side]
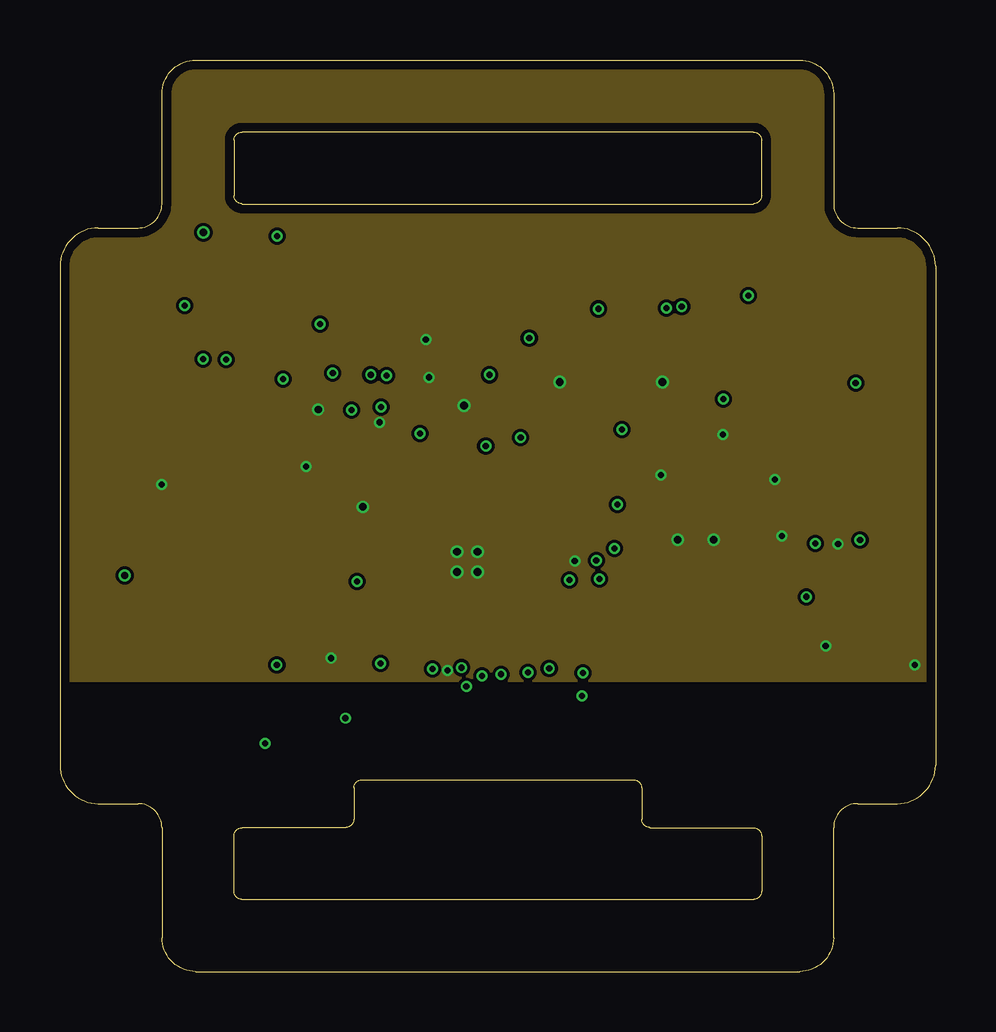
[diagram p3: board, inner layer Route2]
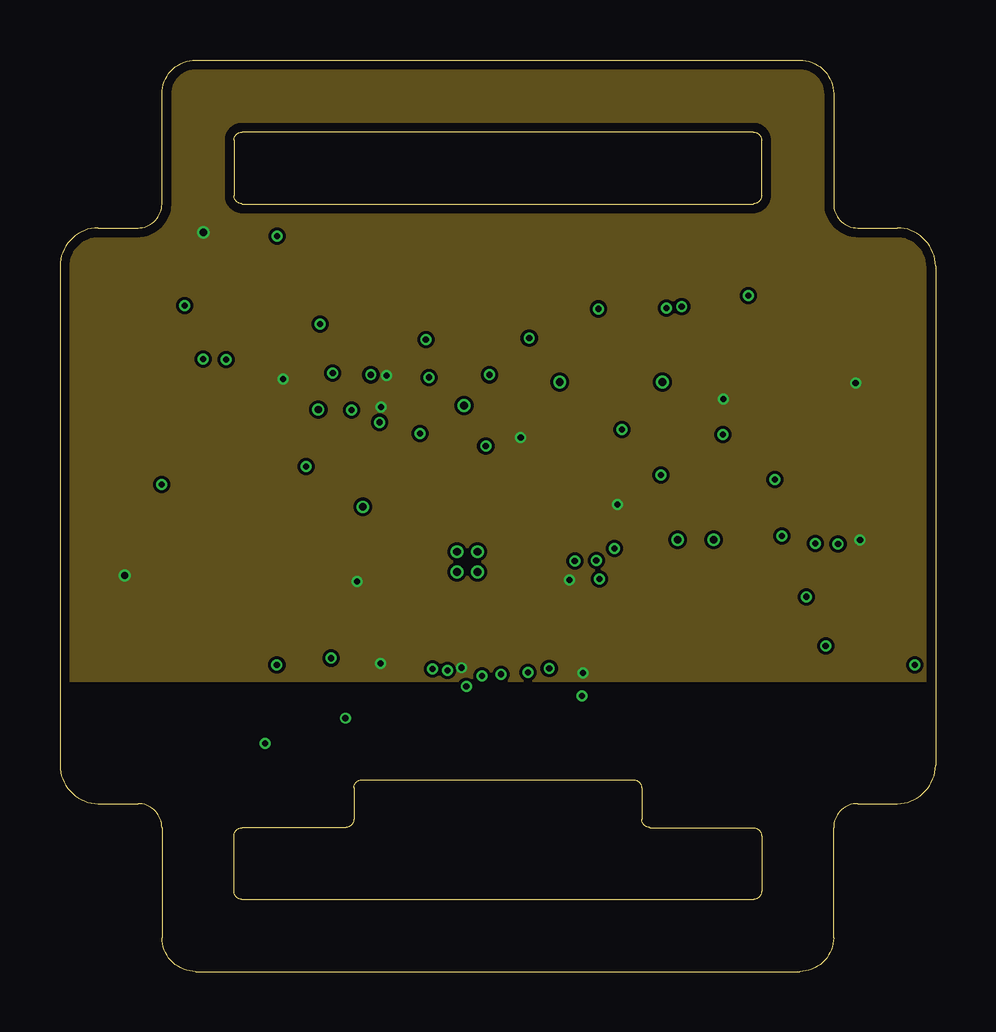
[diagram p4: board, inner layer Route15]
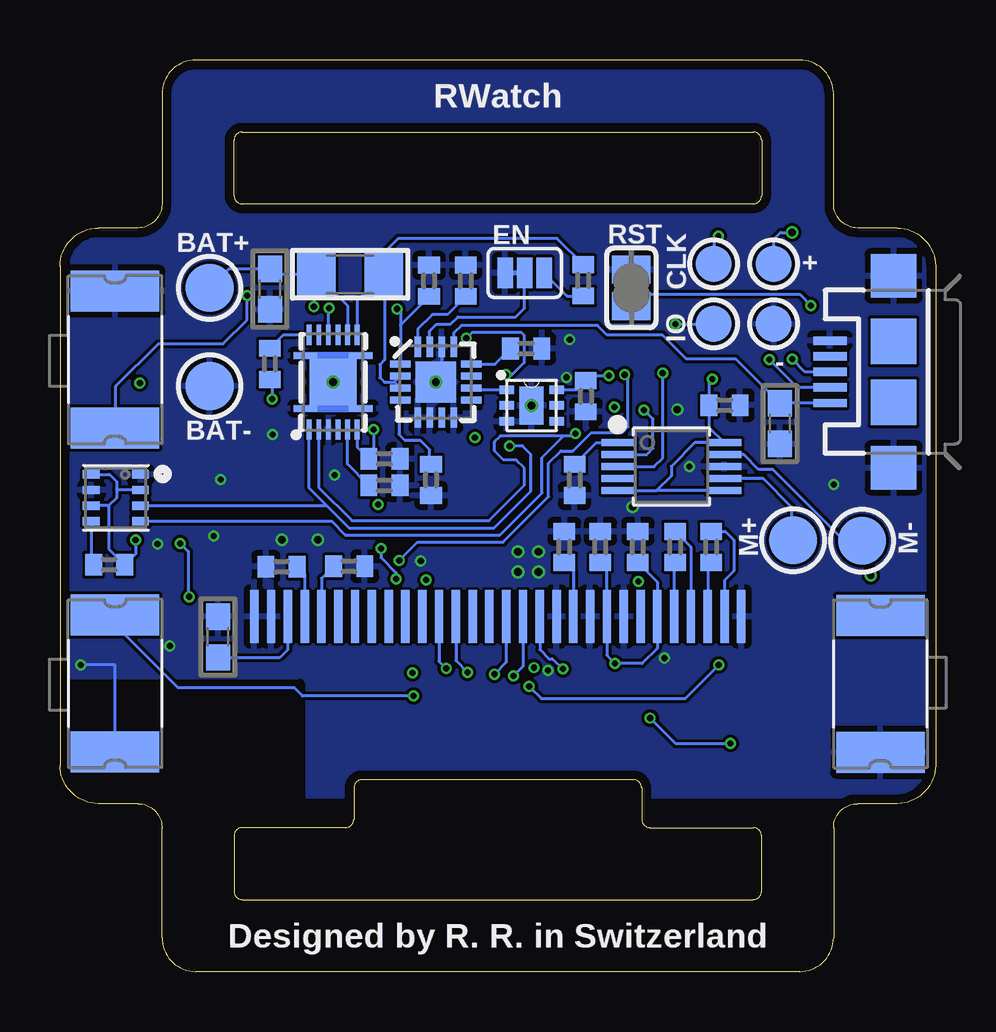
[diagram p5: board, bottom side, seen from below]

Size 36.5 x 38 mm. Coordinates in mm from the lower left corner, seen from the top.
Outline: 0,29.4 0,8.6 arc90 1.6,7 3.25,7 arc-90 4.25,6 4.25,1.41 arc90 5.66,0 30.84,0 arc90 32.25,1.41 32.25,6 arc-90 33.25,7 34.9,7 arc90 36.5,8.6 36.5,29.4 arc90 34.9,31 33.25,31 arc-90 32.25,32 32.25,36.59 arc90 30.84,38 5.66,38 arc90 4.25,36.59 4.25,32 arc-90 3.25,31 1.6,31 arc90 0,29.4
Outline: 28.9,6 arc-90 29.25,5.65 29.25,3.35 arc-90 28.9,3 7.6,3 arc-90 7.25,3.35 7.25,5.65 arc-90 7.6,6 11.9,6 arc90 12.25,6.35 12.25,7.65 arc-90 12.6,8 23.9,8 arc-90 24.25,7.65 24.25,6.35 arc90 24.6,6 28.9,6
Outline: 29.25,32.35 29.25,34.65 arc90 28.9,35 7.6,35 arc90 7.25,34.65 7.25,32.35 arc90 7.6,32 28.9,32 arc90 29.25,32.35
Copper layers (1*2*15*16): Top 0.035559375mm / dielectric 0.17018125mm / Route2 0.01778125mm / dielectric 47mil / Route15 0.01778125mm / dielectric 0.17018125mm / Bottom 0.035559375mm
Design rules "OSHPark-4layer-tented": minimum track width 5mil, minimum drill 10mil, track to track 5mil, track to pad 5mil, pad to pad 5mil, via to via 5mil, smd to smd 5mil, copper to edge 15mil, drill to drill 6mil, minimum pad ring 4mil, minimum via ring 4mil, stop-mask expansion 2.5mil, vias tented up to drill 12mil, thermal gap 10mil
tRestrict: area -0.2,-1 to 36.8,7; area 23.5,7.2 to 36.8,12; area 23.5,12.2 to 31.2,15.6
bRestrict: area -0.2,-1 to 36.8,7; area 26.5,7.2 to 36.8,12

### Footprints (pad centres in the part's own frame; a part is rotated, then mirrored left to right if it is on the bottom)
TESTPOINT_ROUND_1.5MM = smd 1.5 x 1.5: P$1 0,0
CHIPLED_0603_NOOUTLINE = smd 0.8 x 0.8: A 0,-0.75; C 0,0.75
ANT_PCB_2.4GHZ_NRF8001_1.6MM_1OZ = smd 1.27 x 1.27: FEED 0,0; TESTPOINT -8.169,17.605
BALUN0603 = smd 0.2 x 0.5: 1 0.5,0.5; 2 0,0.5; 3 -0.5,0.5; 4 -0.5,-0.5; 5 0,-0.5; 6 0.5,-0.5
TESTPOINT_ROUND_2MM = smd 2 x 2: P$1 0,0
0402 = smd 0.7 x 0.9: 1 -0.65,0; 2 0.65,0
0603 = smd 1.1 x 1: 1 -0.85,0; 2 0.85,0
UG-2864HSWEG01_1.3_WRAPAROUND = smd 0.35 x 2.2 bottom: 1 -10.15,-0.2; 2 -9.45,-0.2; 3 -8.75,-0.2; 4 -8.05,-0.2; 5 -7.35,-0.2; 6 -6.65,-0.2; 7 -5.95,-0.2; 8 -5.25,-0.2; 9 -4.55,-0.2; 10 -3.85,-0.2; 11 -3.15,-0.2; 12 -2.45,-0.2; 13 -1.75,-0.2; 14 -1.05,-0.2; 15 -0.35,-0.2; 16 0.35,-0.2; 17 1.05,-0.2; 18 1.75,-0.2; 19 2.45,-0.2; 20 3.15,-0.2; 21 3.85,-0.2; 22 4.55,-0.2; 23 5.25,-0.2; 24 5.95,-0.2; 25 6.65,-0.2; 26 7.35,-0.2; 27 8.05,-0.2; 28 8.75,-0.2; 29 9.45,-0.2; 30 10.15,-0.2
PAD-JUMPER-3-2OF3_NC_BY_TRACE_YES_SILK_FULL_BOX = smd 0.635 x 1.27: 1 -0.813,0; 2 0,0; 3 0.813,0
0805 = smd 1.3 x 1.5: 1 -0.95,0; 2 0.95,0
USB-MICROB = smd 0.35 x 1.4: D+ 0,2.65; D- -0.65,2.65; GND 1.3,2.65; ID 0.65,2.65; VBUS -1.3,2.65 | smd 1.8 x 1.9: MT1 -4,0; MT2 4,0 | smd 1.9 x 1.9: P$1 -1.27,0; P$2 1.27,0
_0603 = smd 0.9 x 0.8: 1 -0.762,0; 2 0.762,0
1206 = smd 1.6 x 1.8: 1 -1.4,0; 2 1.4,0
SOLDERJUMPER_REFLOW = smd 1.168 x 1.6: 1 -0.762,0; 2 0.762,0
KSS241GLFS = smd 1.7 x 3.7: 1 -2.86,0.045; 2 2.84,0.045
TQFN48_7MM = smd 0.25 x 0.75: 1 -2.75,-3.475; 2 -2.25,-3.475; 3 -1.75,-3.475; 4 -1.25,-3.475; 5 -0.75,-3.475; 6 -0.25,-3.475; 7 0.25,-3.475; 8 0.75,-3.475; 9 1.25,-3.475; 10 1.75,-3.475; 11 2.25,-3.475; 12 2.75,-3.475; 25 2.75,3.475; 26 2.25,3.475; 27 1.75,3.475; 28 1.25,3.475; 29 0.75,3.475; 30 0.25,3.475; 31 -0.25,3.475; 32 -0.75,3.475; 33 -1.25,3.475; 34 -1.75,3.475; 35 -2.25,3.475; 36 -2.75,3.475 | smd 0.75 x 0.25: 13 3.475,-2.75; 14 3.475,-2.25; 15 3.475,-1.75; 16 3.475,-1.25; 17 3.475,-0.75; 18 3.475,-0.25; 19 3.475,0.25; 20 3.475,0.75; 21 3.475,1.25; 22 3.475,1.75; 23 3.475,2.25; 24 3.475,2.75; 37 -3.475,2.75; 38 -3.475,2.25; 39 -3.475,1.75; 40 -3.475,1.25; 41 -3.475,0.75; 42 -3.475,0.25; 43 -3.475,-0.25; 44 -3.475,-0.75; 45 -3.475,-1.25; 46 -3.475,-1.75; 47 -3.475,-2.25; 48 -3.475,-2.75 | smd 4.7 x 4.7: THERMAL 0,0
SON65P200X200X80-7N = smd 0.61 x 0.356: 1 -1.041,0.66; 2 -1.041,0; 3 -1.041,-0.66; 4 1.041,-0.66; 5 1.041,0; 6 1.041,0.66 | smd 0.991 x 1.6: 7 0,0
BME280 = smd 0.7 x 0.35: 1 1.025,0.975; 2 1.025,0.325; 3 1.025,-0.325; 4 1.025,-0.975; 5 -1.025,-0.975; 6 -1.025,-0.325; 7 -1.025,0.325; 8 -1.025,0.975
PDSO-N12 = smd 0.2 x 0.85: 1 -1,-1.975; 2 -0.6,-1.975; 3 -0.2,-1.975; 4 0.2,-1.975; 5 0.6,-1.975; 6 1,-1.975; 7 1,1.975; 8 0.6,1.975; 9 0.2,1.975; 10 -0.2,1.975; 11 -0.6,1.975; 12 -1,1.975 | smd 1.95 x 1.95: EP 0,0 | smd 1 x 0.25: EP1 -1.15,1.1; EP2 -1.15,-1.1; EP3 1.15,-1.1; EP4 1.15,1.1
LGA28R50P4X10_380X520X100 = smd 0.3 x 0.525: 1 -2.25,1.562; 6 -2.25,-1.562; 7 -1.75,-1.562; 8 -1.25,-1.562; 9 -0.75,-1.562; 10 -0.25,-1.562; 11 0.25,-1.562; 12 0.75,-1.562; 13 1.25,-1.562; 14 1.75,-1.562; 15 2.25,-1.562; 20 2.25,1.562; 21 1.75,1.562; 22 1.25,1.562; 23 0.75,1.562; 24 0.25,1.562; 25 -0.25,1.562; 26 -0.75,1.562; 27 -1.25,1.562; 28 -1.75,1.562 | smd 0.425 x 0.3: 2 -2.312,0.75; 3 -2.312,0.25; 4 -2.312,-0.25; 5 -2.312,-0.75; 16 2.312,-0.75; 17 2.312,-0.25; 18 2.312,0.25; 19 2.312,0.75
PVQFN-N16 = smd 0.28 x 0.85: 1 -0.75,-1.475; 2 -0.25,-1.475; 3 0.25,-1.475; 4 0.75,-1.475; 9 0.75,1.475; 10 0.25,1.475; 11 -0.25,1.475; 12 -0.75,1.475 | smd 0.85 x 0.28: 5 1.475,-0.75; 6 1.475,-0.25; 7 1.475,0.25; 8 1.475,0.75; 13 -1.475,0.75; 14 -1.475,0.25; 15 -1.475,-0.25; 16 -1.475,-0.75 | smd 1.7 x 1.7: EP 0,0
QFN32_5MM = smd 0.8 x 0.25: 1 -2.5,1.75; 2 -2.5,1.25; 3 -2.5,0.75; 4 -2.5,0.25; 5 -2.5,-0.25; 6 -2.5,-0.75; 7 -2.5,-1.25; 8 -2.5,-1.75; 17 2.5,-1.75; 18 2.5,-1.25; 19 2.5,-0.75; 20 2.5,-0.25; 21 2.5,0.25; 22 2.5,0.75; 23 2.5,1.25; 24 2.5,1.75 | smd 0.25 x 0.8: 9 -1.75,-2.5; 10 -1.25,-2.5; 11 -0.75,-2.5; 12 -0.25,-2.5; 13 0.25,-2.5; 14 0.75,-2.5; 15 1.25,-2.5; 16 1.75,-2.5; 25 1.75,2.5; 26 1.25,2.5; 27 0.75,2.5; 28 0.25,2.5; 29 -0.25,2.5; 30 -0.75,2.5; 31 -1.25,2.5; 32 -1.75,2.5 | smd 3.5 x 3.5: 33 0,0
PSOP10 = smd 0.28 x 1.45: 1 -1,-2.2; 2 -0.5,-2.2; 3 0,-2.2; 4 0.5,-2.2; 5 1,-2.2; 6 1,2.2; 7 0.5,2.2; 8 0,2.2; 9 -0.5,2.2; 10 -1,2.2
XTAL3215 = smd 1.1 x 1.9: P$1 1.2,0; P$2 -1.2,0
CRYSTAL_2.5X2 = smd 0.9 x 0.8: 1 -0.825,-0.625; 2 0.825,-0.625; 3 0.825,0.625; 4 -0.825,0.625
CRYSTAL_4.9X1.8 = smd 1.3 x 2.2: 1 -2.1,0; 2 2.1,0

### Placement (x,y rotation side)
+  6.75,29.5 90 bottom
-  6.75,27 270 bottom
A5  6.75,9.5 90 top
ANT1  30.75,9.75 90 top
B1  29.88,10.79 270 top
BAT+  30.26,28.49 270 bottom
BAT-  30.26,24.41 90 bottom
C1  34.65,19.1 90 top
C2  34.07,13.14 180 top
C3  26.18,11.5 180 top
C4  35.21,22.4 90 top
C5  27.63,24.77 180 top
C6  22.6,25.38 270 top
C7  33.62,22.4 90 top
C8  31.32,17.02 0 top
C9  30,22.4 90 top
C10  28.44,22.4 90 top
C11  26.87,22.4 90 top
C12  22.46,19.52 90 top
C13  8.8,23.61 0 bottom
C14  15.04,20.5 270 bottom
C15  9.36,17.7 90 bottom
C16  10.86,17.7 90 bottom
C17  29.91,13.94 270 bottom
C18  13.97,17.7 270 bottom
C19  27.26,16.88 0 bottom
C20  12.41,17.7 270 bottom
C21  22.98,20.26 180 bottom
C22  6.48,22.84 90 bottom
C23  11.45,15.33 90 top
C24  14.06,9.35 0 top
C25  18.06,11 0 top
C26  27.75,28.45 90 bottom
C27  6.55,14 90 top
C29  14.58,23.98 90 bottom
C30  3.05,18.6 270 top
C31  22.98,21.37 180 bottom
C36  3.05,22 270 top
C37  8.78,22 270 top
CLK  9.25,29.5 0 bottom
DISP1  18.25,15 0 top
EN  17.13,29.12 180 bottom
FB1  31.76,22.91 270 top
IO  9.25,27 0 bottom
JP1  1.75,25 90 bottom
L4  31.68,20.13 0 top
L5  31.68,18.61 180 top
M+  5.95,17.98 180 bottom
M-  3.07,17.96 0 bottom
R1  31.31,14.81 0 top
R2  22.85,13.11 270 top
R3  34.45,16.96 180 bottom
R5  6.75,11 0 top
R6  19.59,28.79 90 bottom
R7  24.41,29.07 180 bottom
R8  15.48,17.7 270 bottom
R9  24.44,16.9 180 bottom
R10  10.91,19.37 90 top
R11  15.05,23.2 0 top
R12  18.41,23.2 180 top
R13  5.05,14 270 top
R14  27.75,25.33 90 bottom
R15  17.07,25.97 0 bottom
R16  14.69,28.82 90 bottom
R17  3.55,14 270 top
R18  21.03,20.5 90 bottom
R20  21.11,28.79 90 bottom
RST  12.68,28.5 90 bottom
S1  34.25,25.5 270 bottom
S2  34.25,12 270 bottom
S3  2.25,12 90 bottom
U1  16.96,17.08 0 top
U2  16.84,23.59 0 bottom
U3  34.17,19.75 0 bottom
U4  25.11,24.57 0 bottom
U5  7.24,18.23 0 top
U6  20.83,24.57 270 bottom
U7  26.58,17.33 270 top
U8  11.01,21.05 270 bottom
X1  14.55,11.17 180 top
X2  5.96,22 180 top
Y1  34.24,15.85 90 top
Y2  22.97,22.54 180 top

### Tracks (layer width: path | path; a pad name or v marks a point on that pad's centre or on a via)
!CE!
  Bottom 0.127: R18.2 21.08,21.2 21.08,21.75 21.46,22.12 22.11,22.12 22.37,22.39 22.37,23.76 U6.4
!RESET  (via drill 0.25)
  Top 0.127: U1.40 12.96,18.33 12.78,18.15 12.78,17.64 12.07,16.93 10.91,16.93 10.74,16.76 10.74,9.17 9.86,8.29 2.03,8.29 1.32,9 1.32,27.18 1.9,27.76 v5.19,27.76
  Bottom 0.127: RST.1 12.18,28.23 5.66,28.23 v5.19,27.76
+3V3  (via drill 0.25, 0.3)
  Top 0.127: U7.1 28.33,20.69 28.6,20.96 29.21,20.96 C9.1 30.79,22.54 30.79,23.67 30.98,23.86 FB1.1 32.43,24.53 v33.17,24.53 | U1.6 16.71,12.7 v16.75,12.67 | U5.4 5.49,17.98 U5.28 | U5.4 4.93,17.95 C30.2 3.05,16.87 v2.7,16.51 | U5.4 U5.3 | R11.1 13.61,23.2 13.39,23.42 v13.39,23.53 | R12.1 19.21,23.05 v19.21,22.27 | C12.1 22.67,19.08 U7.9 | 22.46,19.17 C12.1 | v23.23,19.46 22.64,19.46 22.46,19.28 C12.1 | R2.2 22.84,12.45 v21.8,12.45 | v21.24,16.33 21.12,16.33 U1.17 19.76,16.33 19.76,19.82 14.21,19.82 U1.36 | U1.44 12.45,16.33 v12.38,16.26
  Bottom 0.127: U2.6 14.95,24.25 C29.2 14.36,24.85 v13.62,24.85 | R14.1 27.65,24.58 v27.65,23.87 | +.P$1 6.75,30.53 6.47,30.81 v5.98,30.81 | C18.2 13.7,16.77 DISP1.9 13.7,13.18 v13.36,12.84 12.23,12.84 11.6,13.47 DISP1.6 11.6,16.24 C20.2 | v9.31,24.7 9.45,24.57 C13.1 9.45,22.68 U8.10 10.03,22.05 11.02,21.06 11.02,20.66 11.63,20.05 | U8.5 11.63,20.05 | U3.8 34.43,20.73 34.14,20.43 34.14,20.07 | 34.14,20.07 34.14,19.74 34.46,19.43 | 34.46,19.43 U3.6 | U3.2 34.14,20.07 | 34.46,19.43 34.46,17.62 R3.1 33.35,17.4 v33.35,17.98 | U8.6 11.63,20.05
  pour Route15: -0.25,-1 36.75,-1 36.75,39 -0.25,39
A5  (via drill 0.25)
  Top 0.127: U1.47 13,14.83 12.88,14.71 12.88,12.87 11.68,11.68 11.68,10.78 v11.9,10.56 | v8.55,9.5 v8.54,9.5 A5.A
  Bottom 0.127: v11.9,10.56 10.84,9.5 v8.55,9.5
AVDD  (via drill 0.25)
  Top 0.127: FB1.2 31.7,21.89 31.84,21.75 C7.1 C4.1 | C8.1 30.12,17.58 U7.29 | C8.1 30.67,18.36 L5.2 31.02,18.61 31.7,19.28 31.7,20.69 31.85,20.84 35.08,20.84 35.24,21.01 35.24,21.75 C4.1 | U7.26 29.73,16.08 30.18,15.62 v31.11,15.62 31.2,15.62 31.2,14.16 30.91,13.87 28.6,13.87 28.33,14.15 U7.24 | 35.24,21.72 C4.1 | C8.1 v31.49,17.85
  Bottom 0.127: v31.49,17.85 31.16,17.51 31.16,15.66 v31.11,15.62
BATT_IN  (via drill 0.25)
  Top 0.127: v23.43,22.59 23.43,23.66 25.92,26.14 v25.92,27.72
  Bottom 0.127: U4.6 24.11,21.86 C31.2 23.43,21.57 v23.43,22.59 | BAT+.P$1 29.45,29.3 C26.2 27.52,29.07 R7.2 | R7.2 24.51,27.77 U4.8 | R7.2 25.92,28.96 v25.92,27.72
CHG_OUT
  Bottom 0.127: U6.11 U6.10 19.29,24.25 U2.1
D4  (via drill 0.25)
  Top 0.127: U1.13 21,14.33 21.17,14.16 21.17,12.08 v21.76,11.49
  Bottom 0.127: v21.76,11.49 26.39,11.49 26.73,11.82 31.57,11.82 34.75,15 34.34,15 S2.1
D12  (via drill 0.25)
  Top 0.127: v17.91,24.88 18.42,24.37 18.42,22.72 18.21,22.51 U1.28 | v19.56,26.4 20.58,26.4 22.36,28.18 v28.71,28.18
  Bottom 0.127: v17.91,24.88 17.66,24.88 17.15,25.38 17.15,26.53 17.28,26.65 19.31,26.65 v19.56,26.4 | S1.2 34.17,22.72 34.17,24.4 32.39,26.18 29.69,26.18 28.71,27.16 v28.71,28.18
D+  (via drill 0.25)
  Top 0.127: v5.97,25.53 4.68,24.24 2.52,24.24 1.65,23.38 1.65,9.18 2.26,8.58 9.69,8.58 10.44,9.32 10.44,17 10.68,17.24 11.3,17.24 11.94,17.88 11.94,20.78 12.84,21.68 14.93,21.68 15.21,21.4 U1.34
  Bottom 0.127: JP1.D+ 5.44,25 v5.97,25.53
D-  (via drill 0.25)
  Top 0.127: v6.92,25.52 5.35,23.95 2.74,23.95 1.94,23.15 1.94,9.31 2.4,8.85 9.56,8.85 10.15,9.44 10.15,17.15 10.62,17.61 11.24,17.61 11.68,18.04 11.68,20.94 12.71,21.97 15.21,21.97 15.71,21.47 U1.33
  Bottom 0.127: JP1.D- 5.75,24.35 v6.92,25.52
GND  (via drill 0.25, 0.3, 0.33)
  Top 0.127: v16.55,17.5 16.55,17.08 U1.THERMAL | v17.4,16.65 17.4,17 16.75,17 | C3.2 25.53,11.45 24.75,11.45 | U7.18 U7.17 24.83,11.53 24.75,11.45 | 24.75,11.45 23.21,11.45 | U7.33 27.63,18.37 | 27.63,18.37 27.83,18.58 U7.31 | U7.23 27.83,18.37 27.63,18.37
  Top 0.305: 32.25,13 32.25,10.79 B1.2
  Bottom 0.127: S2.2 34.2,12.78 v35.64,12.78 | U6.14 20.58,24.82 U6.EP | U4.EP1 25.11,25.67 U4.EP 25.11,23.47 U4.EP2 | U4.EP4 25.11,25.67 U4.EP 25.11,23.47 U4.EP3
  other vias: 11.31,13.06 20.83,24.57 17.4,17.5 16.55,16.65 12.63,19.37 10.77,23.43 31.92,13.58 29.8,20.5 25.75,18 27.25,18 30.1,18.15 13.32,22.9 21.46,17.11 32.44,17.82 10.27,21.05 25.05,20.7 4.24,20.3 16.85,23.59 15.25,26.35 15.38,24.77 27.63,22.38 25.11,24.57 16.15,12.55
  pour Top: 36.75,39 -0.25,39 -0.25,-1 36.75,-1
  pour Bottom: 36.75,39 -0.25,39 -0.25,-1 36.75,-1
  pour Route2: -0.25,-1 36.75,-1 36.75,39 -0.25,39
ILIM
  Bottom 0.127: U6.12 18.36,25.32 R15.1
INT  (via drill 0.25)
  Top 0.127: v16.94,11.89 16.94,11.9 17.14,12.11 17.14,12.48 17.71,13.06 U1.8 17.71,13.12 | v9.04,12.78 8.99,12.82 U5.14
  Bottom 0.127: v16.94,11.89 16.43,11.38 10.44,11.38 v9.04,12.78
ISET
  Bottom 0.127: R6.1 20.34,27.39 20.97,27.39 21.58,26.78 U6.16
MISO  (via drill 0.25)
  Top 0.127: v12.96,24.88 13.47,25.38 19.22,25.38 19.79,24.82 19.79,21.39 20.16,21.01 20.8,21.01 21.09,20.72 21.09,18.65 20.77,18.33 U1.21 | v22.36,17.13 22.61,17.13 23.16,16.58 U7.14
  Bottom 0.127: v22.36,17.13 21.58,17.9 18.03,17.9 16.13,19.8 16.13,21.19 15.62,21.7 15.12,21.7 14.36,22.46 13.08,22.46 12.82,22.71 12.82,24.74 v12.96,24.88
MOSI
  Top 0.127: U7.13 23.03,17.07 22.23,17.88 21.57,17.88 21.02,17.33 U1.19
N$1
  Top 0.127: ANT1.FEED 30.75,9.91 B1.1
N$2
  Top 0.305: U7.22 27.33,14.02 29.53,11.82 30.11,11.82 30.38,11.56 B1.3
N$3
  Top 0.305: U7.21 26.83,13.52 29.06,11.29 B1.4
N$4
  Top 0.305: 26.83,11.49 C3.1 | C3.1 26.33,11.5 U7.20 | C3.1 27.54,10.79 B1.5
N$5
  Top 0.127: L4.2 L5.1 | L5.1
N$6
  Bottom 0.127: R8.2 15.1,16.67 DISP1.11
N$7
  Top 0.127: U7.3 27.33,21.29 C11.1
N$8
  Top 0.127: U7.2 27.83,21.14 C10.1
N$9
  Top 0.127: U7.28 29.69,17.08 30.06,16.71 30.06,16.53 30.27,16.32 33.26,16.32 Y1.3 33.62,17.42 C1.1
N$10
  Top 0.127: U7.27 29.6,16.58 30.14,16.04 32.72,16.04 33.05,15.71 34.19,15.71 Y1.1 34.87,13.29 C2.1
N$11
  Top 0.127: U7.32 29.87,19.08 L4.1
N$12
  Top 0.127: U7.25 29.56,15.58 30.33,14.81 R1.1
N$13
  Bottom 0.127: C21.2 24.51,21.15 U4.5
N$14
  Top 0.127: U1.1 14.21,12.04 X1.P$1 13.35,9.42 C24.1
N$15
  Top 0.127: C25.1 16.12,11 X1.P$2 14.71,12.21 U1.2
N$16
  Bottom 0.127: U3.5 35.19,17.05 R3.2
N$18
  Bottom 0.127: C14.1 14.14,22.05 U8.1
N$19
  cutout Route2: -0.25,-1 36.75,-1 36.75,12 -0.25,12
  cutout Route15: -0.25,-1 36.75,-1 36.75,12 -0.25,12
N$21
  Bottom 0.127: R14.2 27.18,26.55 U4.12
N$22
  Top 0.127: C5.2 26.43,24.77 25.07,23.41 Y2.1 25.07,22.25 26.83,20.49 U7.4
N$23
  Top 0.127: U7.5 26.33,20.5 25.6,21.23 23.97,21.23 22.65,22.54 Y2.2 22.61,24.28 C6.2
N$26
  Bottom 0.127: EN.1 15.36,28.17 R16.1
N$28
  Top 0.127: R5.1 6,10.9 A5.C
N$29
  Top 0.127: C27.2 6.49,14.71 U5.9
N$30
  Top 0.127: R10.1 10.17,17.98 U5.17
N$31
  Top 0.127: R17.1 3.55,16.64 4.39,17.48 U5.5
N$32
  Top 0.127: R13.1 4.99,14.71 U5.6
N$34
  Bottom 0.127: R9.2 25.6,16.39 DISP1.26
N$35
  Bottom 0.127: C15.2 8.77,18.35 8.41,17.99 8.41,16.7 8.8,16.31 DISP1.2
N$36
  Bottom 0.127: C15.1 9.5,16.91 DISP1.3
N$37
  Bottom 0.127: C16.2 10.2,17.69 DISP1.4
N$38
  Bottom 0.127: C16.1 10.9,17.01 DISP1.5
N$39
  Bottom 0.127: C17.2 27.32,13.09 27,13.42 DISP1.28
N$40
  Bottom 0.127: C19.2 26.3,16.56 DISP1.27
OLED_CS  (via drill 0.25)
  Top 0.127: U1.3 15.21,12.93 v15.54,12.61
  Bottom 0.127: DISP1.13 16.5,13.42 16.11,13.04 15.97,13.04 v15.54,12.61
OLED_DC  (via drill 0.25)
  Top 0.127: v18.39,12.39 18.71,12.71 U1.10
  Bottom 0.127: DISP1.15 17.9,12.88 v18.39,12.39
OLED_MOSI  (via drill 0.25)
  Top 0.127: v20.39,12.63 20.36,12.6 20.11,12.6 19.71,13 U1.12
  Bottom 0.127: DISP1.19 20.7,12.94 v20.39,12.63
OLED_RES  (via drill 0.25)
  Top 0.127: v17.59,12.32 18.21,12.94 U1.9
  Bottom 0.127: DISP1.14 17.2,12.71 v17.59,12.32
OLED_SCK  (via drill 0.25)
  Top 0.127: v19.5,12.47 19.21,12.77 U1.11
  Bottom 0.127: DISP1.18 20,12.97 v19.5,12.47
OUT+
  Bottom 0.127: M+.P$1 5.99,18.02 5.99,19.35 7.18,20.55 U8.7
OUT-
  Bottom 0.127: M-.P$1 3.81,17.96 6.78,20.93 7.38,20.93 8,21.55 U8.9
RDYN
  Top 0.127: U1.14 22.55,14.83 | 22.55,14.83 22.78,14.6 22.78,13.82 R2.1 | 22.55,14.83 23.29,15.58 U7.16
REQN  (via drill 0.25)
  Top 0.127: U1.15 20.45,15.35 21.47,15.35 v22.48,16.37 | v23.12,17.64 23.18,17.58 U7.12
  Bottom 0.127: v22.48,16.37 22.48,16.62 23.12,17.26 v23.12,17.64
SCK
  Top 0.127: U1.20 21.02,17.83 21.42,18.24 23.17,18.24 23.33,18.08 U7.11
SCL  (via drill 0.25)
  Top 0.127: 12.72,23.98 14.91,23.98 R11.2 16.21,22.69 16.21,22 | 12.72,23.98 10.21,23.98 9.8,23.57 9.8,20.4 10.16,20.05 10.16,19.22 9.92,18.98 U5.19 | v12.15,23.41 12.72,23.98 | 16.21,22 U1.32 | v15.01,22.43 15.78,22.43 16.21,22
  Bottom 0.127: U8.2 12.04,21.55 11.77,21.82 11.77,23.03 v12.15,23.41 | 15.51,22.33 14.95,22.33 15,22.39 v15.01,22.43 | 15.51,22.33 18.14,22.33 18.38,22.09 18.38,21.69 18.02,21.33 17.48,21.33 17.14,20.98 17.14,20.27 18.61,18.8 24.32,18.8 25.71,20.19 U4.2 | U3.4 25.18,18.77 24.61,18.21 18.15,18.21 16.4,19.95 16.4,21.44 15.51,22.33
SDA  (via drill 0.25)
  Top 0.127: U5.20 9.49,23.78 9.98,24.27 | 9.98,24.27 17.25,24.27 17.76,23.75 R12.2 v17.75,21.91 17.06,21.91 16.71,21.56 U1.31 | v11.37,24.95 10.66,24.95 9.98,24.27
  Bottom 0.127: U8.3 11.73,21.05 11.37,21.41 v11.37,24.95 | 25.38,19.43 26.11,20.15 U4.1 | U3.3 25.38,19.43 | 25.38,19.43 24.43,18.48 18.42,18.48 16.87,20.03 16.87,21.56 17.21,21.91 v17.75,21.91
SWCLK  (via drill 0.25)
  Top 0.127: U1.45 12.57,15.83 12.22,15.48 12.22,13.08 11.03,11.88 11.03,8.99 10.04,8 1.92,8 1.01,8.91 1.01,27.43 2.49,28.91 7.31,28.91 v9.06,30.66
  Bottom 0.127: v9.06,30.66 9.25,30.47 CLK.P$1
SWDIO  (via drill 0.25)
  Top 0.127: U1.46 12.7,15.33 12.53,15.17 12.53,12.99 11.31,11.77 11.31,8.86 10.19,7.74 1.73,7.74 0.75,8.72 0.75,27.68 2.32,29.26 6.47,29.26 8.6,31.38 9.88,31.38 10.85,30.42 v10.85,27
  Bottom 0.127: v10.85,27 10.35,27 IO.P$1
SYSOFF
  Bottom 0.127: U6.15 21.08,26.69 20.79,26.98 20.22,26.98 19.91,27.29 17.5,27.29 17.13,27.66 EN.2
TS  (via drill 0.25)
  Top 0.127: v25.28,27.65 25.26,27.62 v22.44,27.62
  Bottom 0.127: R20.1 22.31,26.95 | 22.31,26.95 U6.1 | v22.44,27.62 22.31,27.49 22.31,26.95 | U4.10 25.31,27.62 v25.28,27.65
VBAT
  Bottom 0.127: R7.1 24.11,27.96 U4.7 | R7.1 22.97,29.03 22.97,25.5 23.16,25.31 23.16,24.75 22.98,24.57 22.56,24.57 | 22.56,24.57 U6.2 | U6.3 22.55,24.57 22.56,24.57 | R16.2 15.78,30.56 22.4,30.56 23.01,29.95 R7.1
VBUS
  Bottom 0.127: JP1.VBUS C22.2 8.32,25.53 10.39,25.53 11.4,26.54 13.69,26.54 14.09,26.94 19.76,26.94 20.08,26.61 U6.13
VDDCORE1
  Top 0.127: 11.54,16.06 C23.2 11.5,15.98 12.36,16.83 U1.43
XIN_BNO
  Top 0.127: U5.27 5.99,20.77 X2.P$1 4.76,22.65 C36.1
XOUT_BNO
  Top 0.127: X2.P$2 6.71,21.54 | 6.71,21.54 6.49,21.33 U5.26 | C37.1 6.71,22.65 6.71,21.54

### Text on the board
tNames: CUT OUT | Rev. B - FEB 2017 | CUT OUT
bNames: RWatch | M- | M+ | Designed by R. R. in Switzerland
Document: 5 MIL TRACES 10 MIL DRILL | 12 MIL TRACES FOR RF